# Altium schematic sheet SuperCapV3Power.SchDoc
size A4
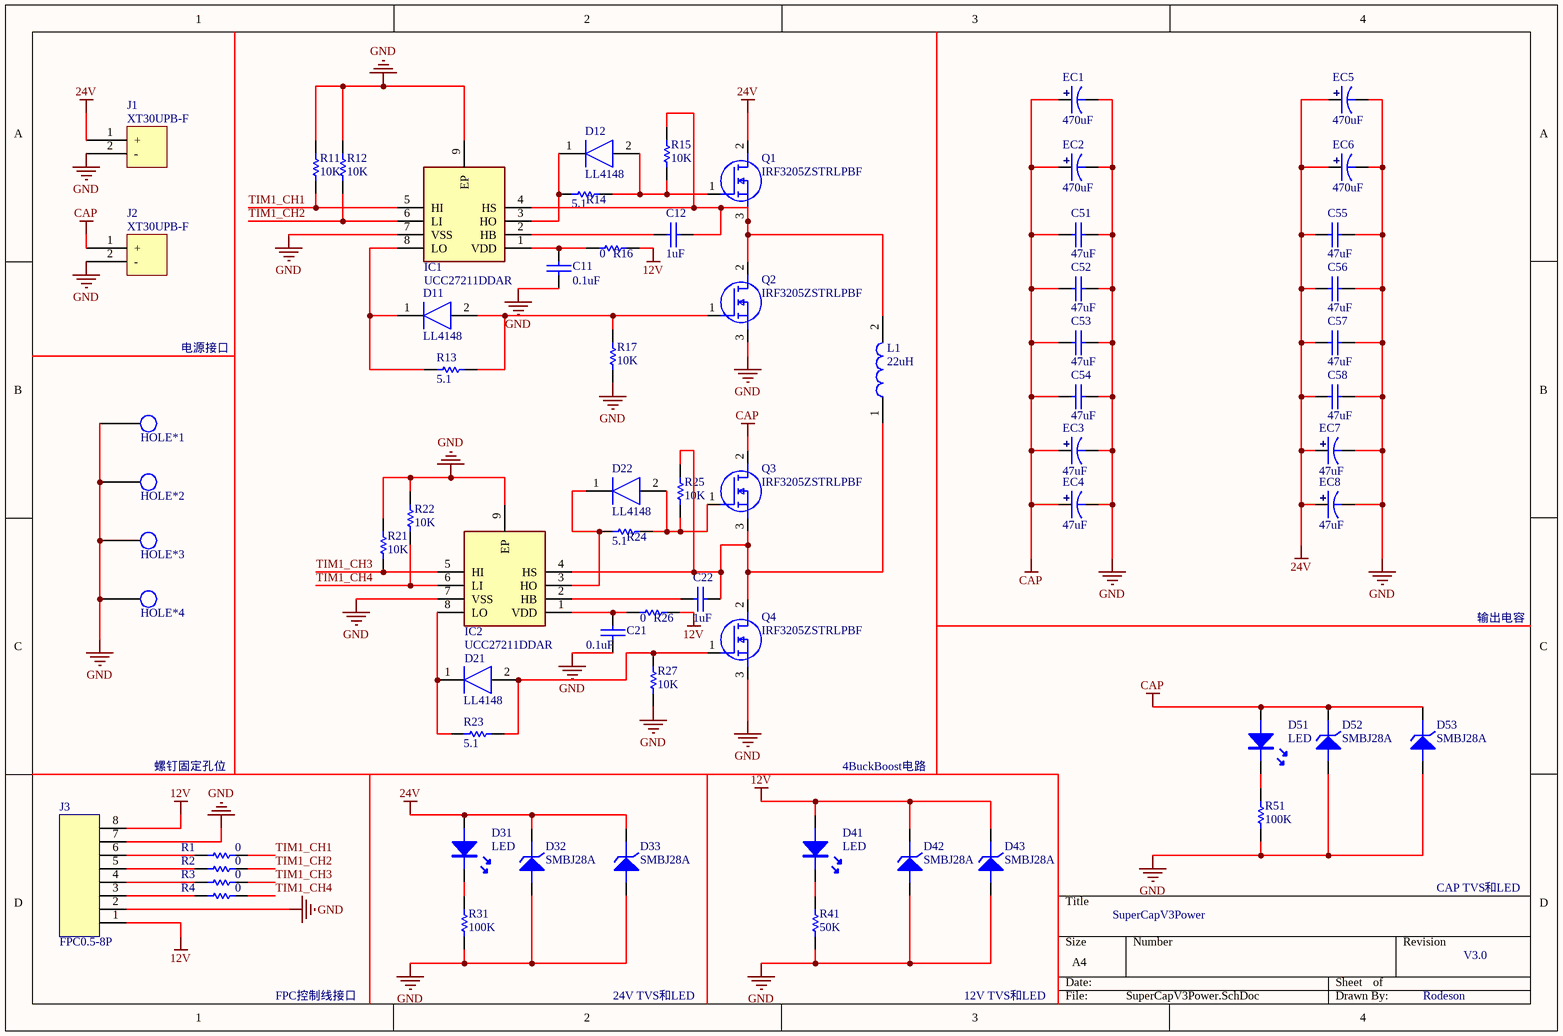
[diagram p0: SuperCapV3Power.SchDoc]

## Parts
C11  0.1uF  [0603C]
C12  1uF  [0603C]
C21  0.1uF  [0603C]
C22  1uF  [0603C]
C51  47uF  [1812C]
C52  47uF  [1812C]
C53  47uF  [1812C]
C54  47uF  [1812C]
C55  47uF  [1812C]
C56  47uF  [1812C]
C57  47uF  [1812C]
C58  47uF  [1812C]
D11  LL4148  [FDLL4448]
D12  LL4148  [FDLL4448]
D21  LL4148  [FDLL4448]
D22  LL4148  [FDLL4448]
D31  LED  [LED-0603G]
D32  SMBJ28A  [SMC/DO-214AB]
D33  SMBJ28A  [SMC/DO-214AB]
D41  LED  [LED-0603G]
D42  SMBJ28A  [SMC/DO-214AB]
D43  SMBJ28A  [SMC/DO-214AB]
D51  LED  [LED-0603G]
D52  SMBJ28A  [SMC/DO-214AB]
D53  SMBJ28A  [SMC/DO-214AB]
EC1  470uF  [DIP-EC5.0X10X16-A]
EC2  470uF  [DIP-EC5.0X10X16-A]
EC3  47uF  [SMD-EC10X10X10]
EC4  47uF  [SMD-EC10X10X10]
EC5  470uF  [DIP-EC5.0X10X16-A]
EC6  470uF  [DIP-EC5.0X10X16-A]
EC7  47uF  [SMD-EC10X10X10]
EC8  47uF  [SMD-EC10X10X10]
HOLE*1  Hole  [M3]  (value not drawn)
HOLE*2  Hole  [M3]  (value not drawn)
HOLE*3  Hole  [M3]  (value not drawn)
HOLE*4  Hole  [M3]  (value not drawn)
IC1  UCC27211DDAR  [SOIC127P600X170-9N]
IC2  UCC27211DDAR  [SOIC127P600X170-9N]
J1  XT30UPB-F  [XT30UPB-F]  (value not drawn)
J2  XT30UPB-F  [XT30UPB-F]  (value not drawn)
J3  FPC0.5-8P  [FPC0.5-8P]
L1  22uH  [INDPM180170X700N]
Q1  IRF3205ZSTRLPBF  [IDB30E60]
Q2  IRF3205ZSTRLPBF  [IDB30E60]
Q3  IRF3205ZSTRLPBF  [IDB30E60]
Q4  IRF3205ZSTRLPBF  [IDB30E60]
R1  0  [0603R]
R2  0  [0603R]
R3  0  [0603R]
R4  0  [0603R]
R11  10K  [0603R]
R12  10K  [0603R]
R13  5.1  [0603R]
R14  5.1  [0603R]
R15  10K  [0603R]
R16  0  [0603R]
R17  10K  [0603R]
R21  10K  [0603R]
R22  10K  [0603R]
R23  5.1  [0603R]
R24  5.1  [0603R]
R25  10K  [0603R]
R26  0  [0603R]
R27  10K  [0603R]
R31  100K  [0603R]
R41  50K  [0603R]
R51  100K  [0603R]

## Nets
12V: D41.A D42.K D43.K J3.1 J3.8 R16.2 R26.2
24V: C55.1 C56.1 C57.1 C58.1 D31.A D32.K D33.K EC5.1 EC6.1 EC7.1 EC8.1 J1.1(+) Q1.2(D)
CAP: C51.1 C52.1 C53.1 C54.1 D51.A D52.K D53.K EC1.1 EC2.1 EC3.1 EC4.1 J2.1(+) Q3.2(D)
GND: C11.1 C21.1 C51.2 C52.2 C53.2 C54.2 C55.2 C56.2 C57.2 C58.2 D32.A D33.A D42.A D43.A D52.A D53.A EC1.2 EC2.2 EC3.2 EC4.2 EC5.2 EC6.2 EC7.2 EC8.2 HOLE*1.1 HOLE*2.1 HOLE*3.1 HOLE*4.1 IC1.7(VSS) IC1.9(EP) IC2.7(VSS) IC2.9(EP) J1.2(-) J2.2(-) J3.2 J3.7 Q2.3(S) Q4.3(S) R11.2 R12.2 R17.1 R21.2 R22.2 R27.1 R31.1 R41.1 R51.1
TIM1_CH1: IC1.5(HI) R1.2 R11.1
TIM1_CH2: IC1.6(LI) R2.2 R12.1
TIM1_CH3: IC2.5(HI) R3.2 R21.1
TIM1_CH4: IC2.6(LI) R4.2 R22.1
NetC11_2: C11.2 IC1.1(VDD) R16.1
NetC12_1: C12.1 IC1.4(HS) L1.2 Q1.3(S) Q2.2(D) R15.2
NetC12_2: C12.2 IC1.2(HB)
NetC21_2: C21.2 IC2.1(VDD) R26.1
NetC22_1: C22.1 IC2.4(HS) L1.1 Q3.3(S) Q4.2(D) R25.2
NetC22_2: C22.2 IC2.2(HB)
NetD11_1: D11.1(K) IC1.8(LO) R13.1
NetD11_2: D11.2(A) Q2.1(G) R13.2 R17.2
NetD12_1: D12.1(K) IC1.3(HO) R14.1
NetD12_2: D12.2(A) Q1.1(G) R14.2 R15.1
NetD21_1: D21.1(K) IC2.8(LO) R23.1
NetD21_2: D21.2(A) Q4.1(G) R23.2 R27.2
NetD22_1: D22.1(K) IC2.3(HO) R24.1
NetD22_2: D22.2(A) Q3.1(G) R24.2 R25.1
NetD31_K: D31.K R31.2
NetD41_K: D41.K R41.2
NetD51_K: D51.K R51.2
NetJ3_3: J3.3 R4.1
NetJ3_4: J3.4 R3.1
NetJ3_5: J3.5 R2.1
NetJ3_6: J3.6 R1.1

## Notes on the sheet
- 电源接口
- 输出电容
- 螺钉固定孔位
- 4BuckBoost电路
- SuperCapV3Power
- CAP TVS和LED
- V3.0
- FPC控制线接口
- 24V TVS和LED
- 12V TVS和LED
- Rodeson

## Library data of the parts
C11 C12 C21 C22 C51-C58 = CAP: 无极性电容
D11 D12 D21 D22 = LL4148: Diode; Manufacturer_Name: ON Semiconductor; Datasheet Link: https://www.onsemi.com/pub/Collateral/LL4148-D.pdf; Height: 1mm; Manufacturer_Part_Number: LL4148; Mouser Part Number: 512-LL4148; Mouser Price/Stock: https://www.mouser.co.uk/ProductDetail/ON-Semiconductor-Fairchild/LL4148?qs=z%2Fr5wmDnQfY5jXgsdLPkRg%3D%3D; Arrow Part Number: LL4148; Arrow Price/Stock: https://www.arrow.com/en/products/ll4148/on-semiconductor?region=asia
D32 D33 D42 D43 D52 D53 = DIODE ZENER: 稳压二极管
EC1 EC2 EC5 EC6 = DIP_ECAP: 直插电解电容
EC3 EC4 EC7 EC8 = SMD_ECAP: 贴片电解电容
IC1 IC2 = UCC27211DDAR: Integrated Circuit; Manufacturer_Name: Texas Instruments; Datasheet Link: http://www.ti.com/lit/gpn/UCC27211; Height: 1.7mm; Manufacturer_Part_Number: UCC27211DDAR; Mouser Part Number: 595-UCC27211DDAR; Mouser Price/Stock: https://www.mouser.co.uk/ProductDetail/Texas-Instruments/UCC27211DDAR?qs=o1A9MY8yOkUTp5ljYZfoNg%3D%3D; Arrow Part Number: UCC27211DDAR; Arrow Price/Stock: https://www.arrow.com/en/products/ucc27211ddar/texas-instruments
J3 = FPC0.5-8P: 贴片
L1 = BCIHP1770-100M: Inductor; Manufacturer_Name: BC(Bao Cheng Elec); Datasheet Link: https://datasheet.lcsc.com/szlcsc/Bao-Cheng-Elec-BC-BCIHP1770-100M_C237980.pdf; Height: 7mm; Manufacturer_Part_Number: BCIHP1770-100M
Q1-Q4 = IRF3205ZSTRLPBF: MOSFET (N-Channel); Manufacturer_Name: Infineon; Datasheet Link: https://www.infineon.com/dgdl/irf3205zpbf.pdf?fileId=5546d462533600a4015355df030c190f; Manufacturer_Part_Number: IRF3205ZSTRLPBF; Mouser Part Number: 942-IRF3205ZSTRLPBF; Mouser Price/Stock: https://www.mouser.co.uk/ProductDetail/Infineon-IR/IRF3205ZSTRLPBF?qs=2r01AXMCG3MP3VtI3Ve68w%3D%3D; Arrow Part Number: IRF3205ZSTRLPBF; Arrow Price/Stock: https://www.arrow.com/en/products/irf3205zstrlpbf/infineon-technologies-ag?region=nac
R1-R4 R11-R17 R21-R27 R31 R41 R51 = RES